# EasyEDA Pro project Milliways.eprj

# Schematic Schematic

## Sheets
1 Input Output: Board Name: Board1; Create Date: 2024-05-10; Page Name: Input Output; Project Name: Milliways; Schematic Name: Schematic; Update Date: 2025-07-20; Company: whitecottage.org.uk; Drawn: Oliver Gardiner; Page Size: A4; Part Number: JLCPCB-002; Reviewed: Oliver Gardiner; Version: V0.1
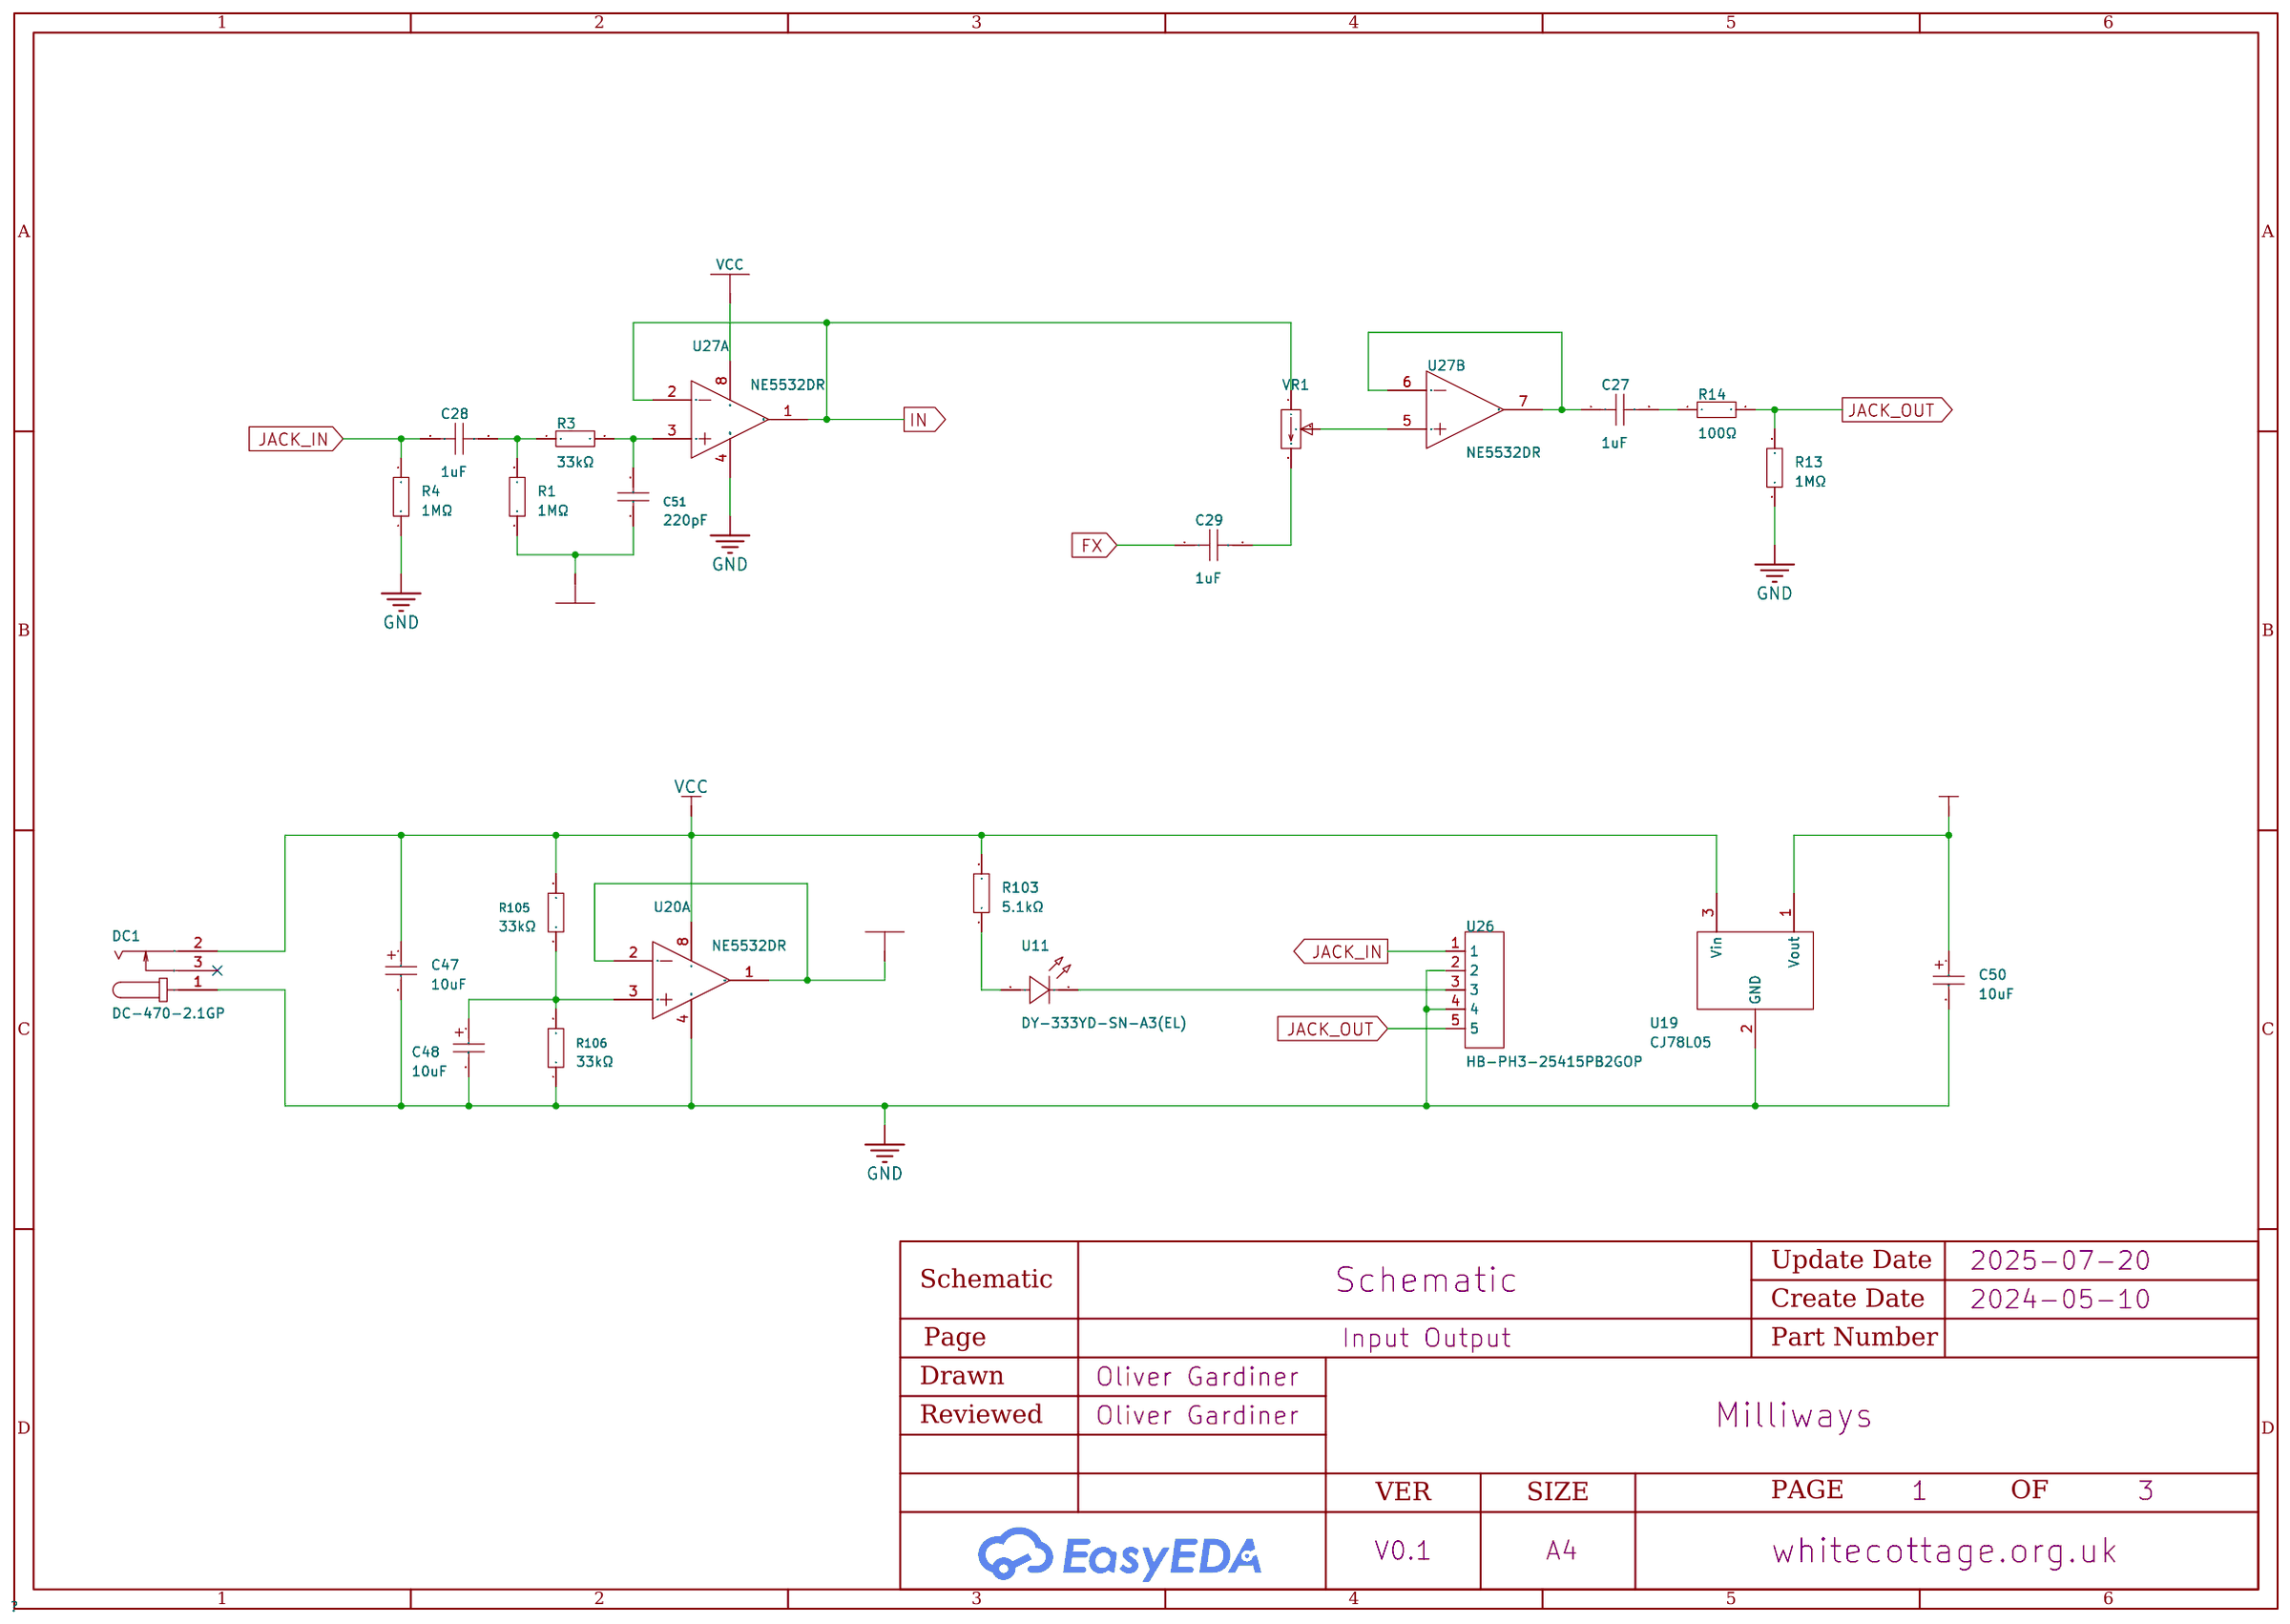
[diagram p0: Input Output]
2 Envelope Detector: Create Date: 2024-05-15; Page Name: Envelope Detector; Update Date: 2025-07-17; Company: EasyEDA.com; Drawn: EasyEDA; Reviewed: EasyEDA
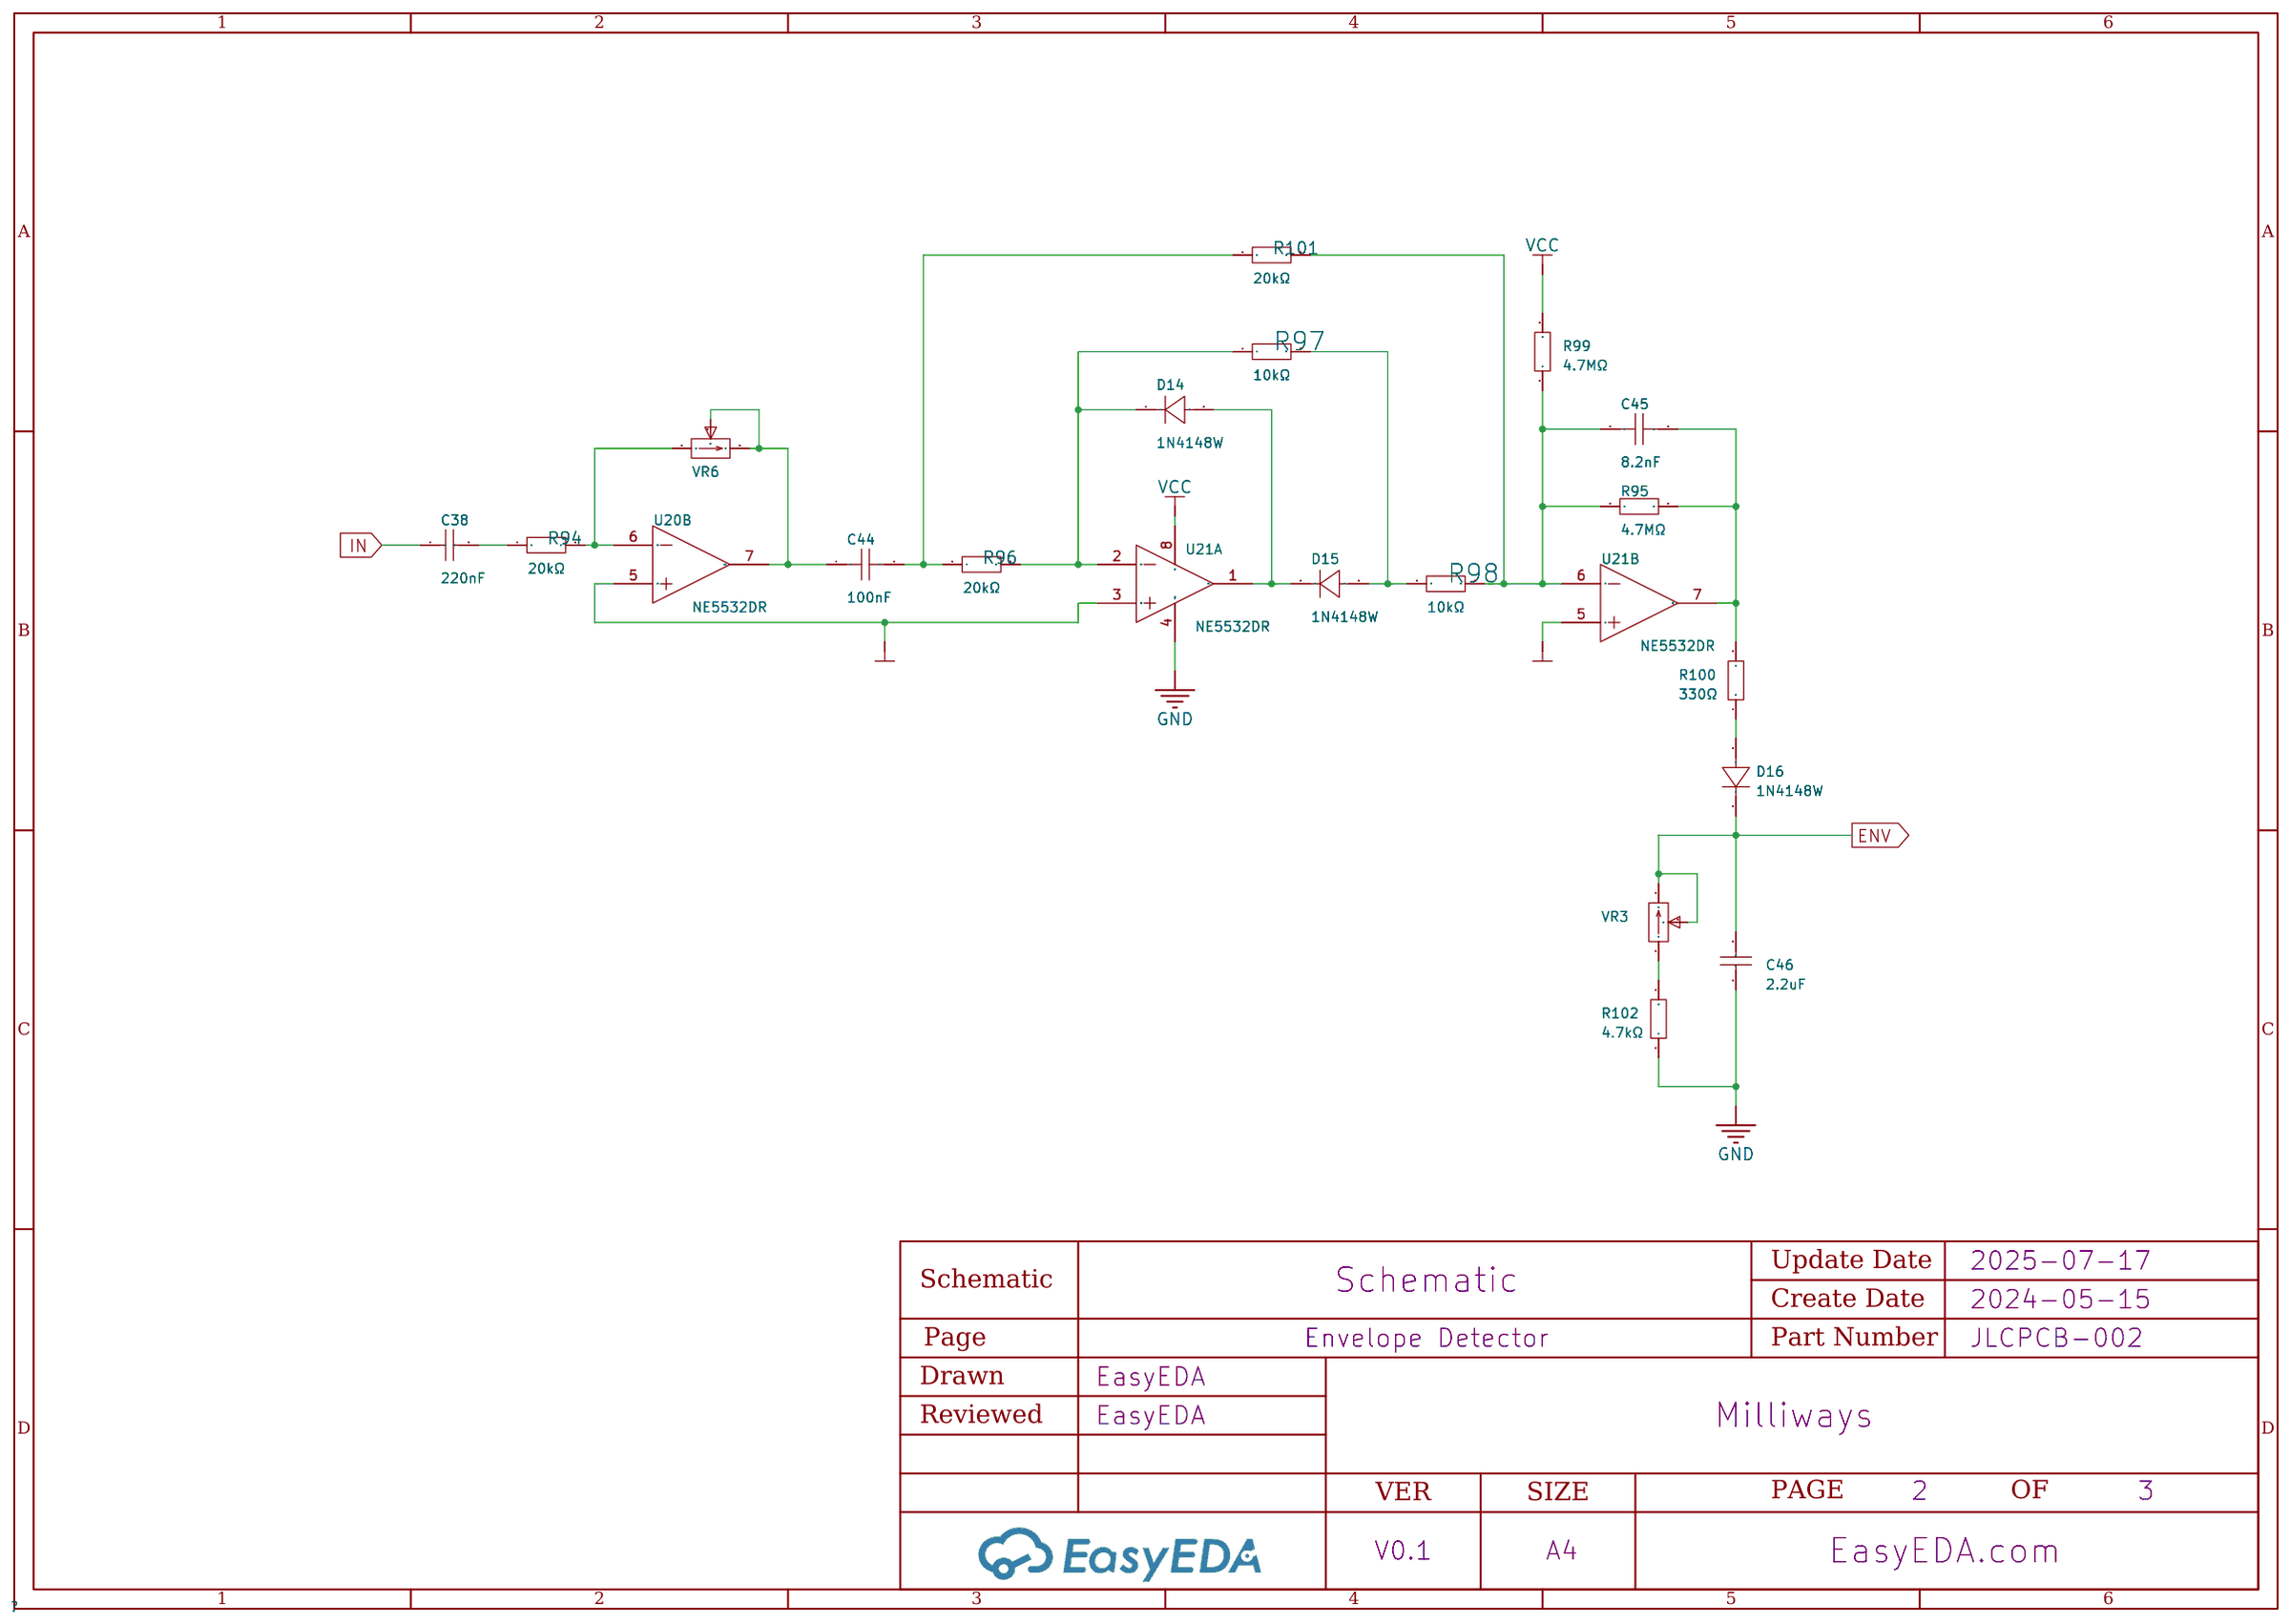
[diagram p1: Envelope Detector]
3 Filter: Create Date: 2024-05-15; Page Name: Filter; Update Date: 2025-07-19; Company: EasyEDA.com; Drawn: EasyEDA; Reviewed: EasyEDA
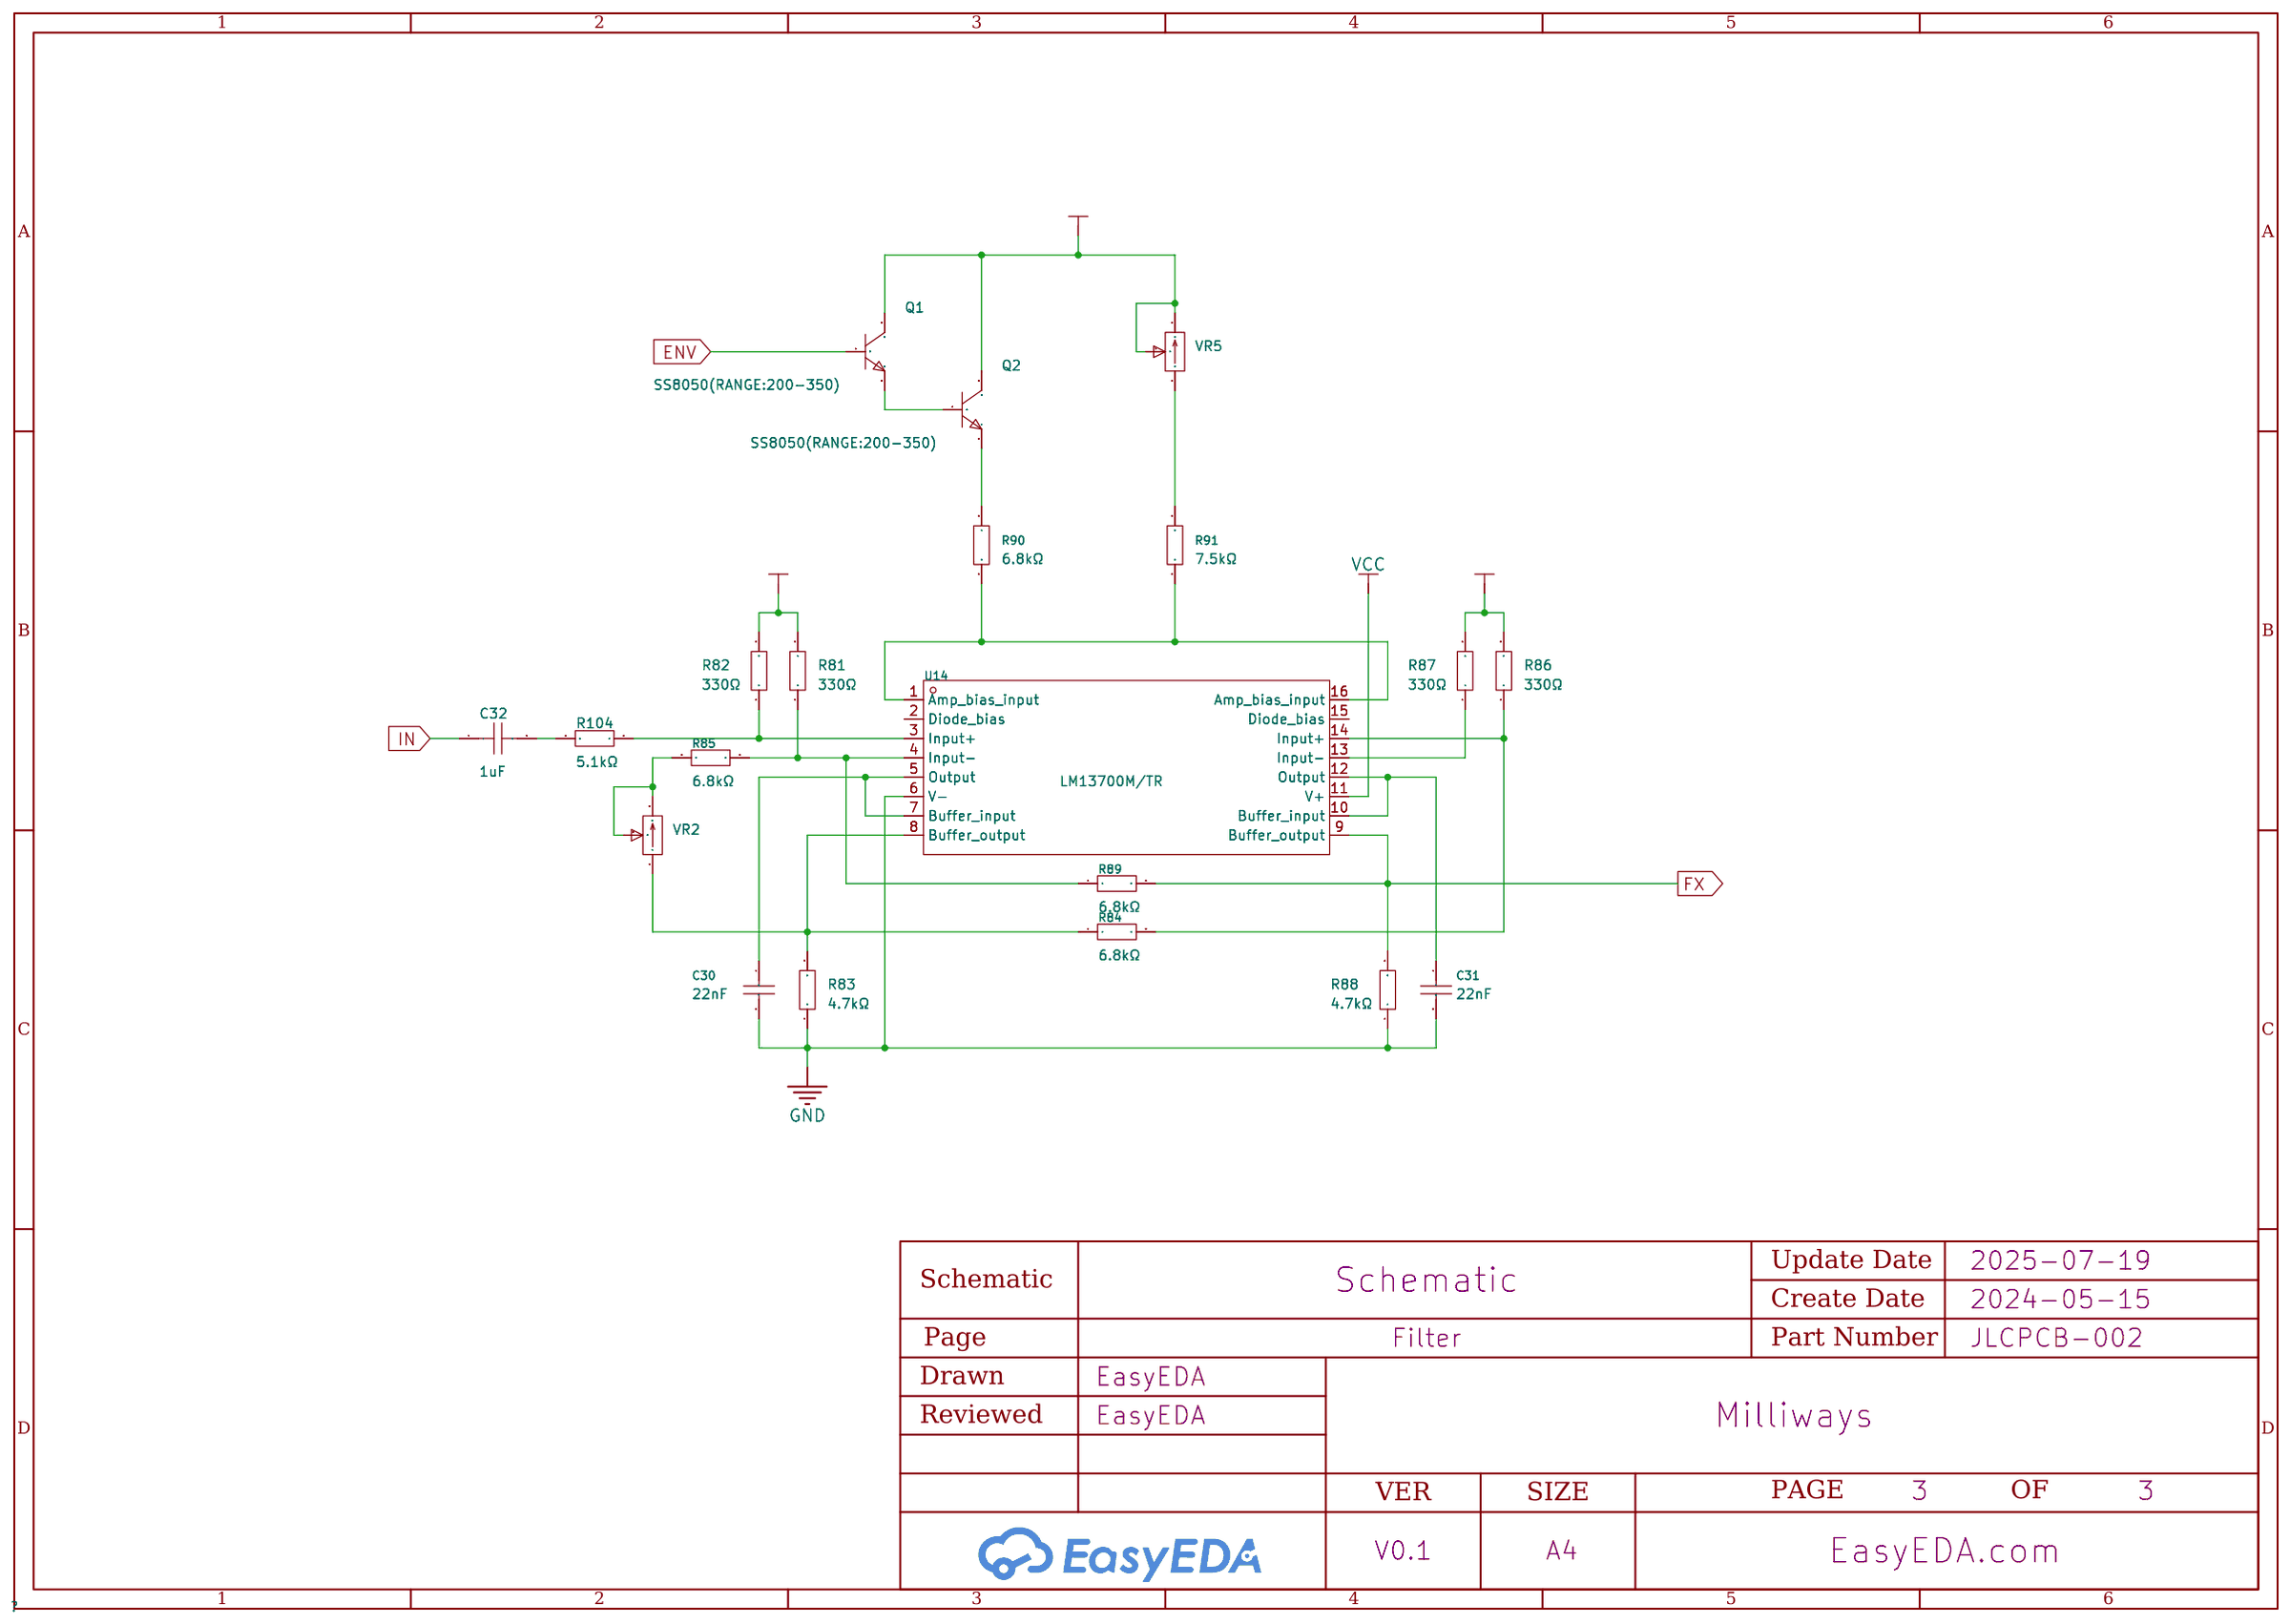
[diagram p2: Filter]

## Parts
sheet Envelope Detector
C38  220nF  [C0603]
C44  100nF  [C0603]
C45  8.2nF  [C0603]
C46  2.2uF  [C0603]
D14  1N4148W  [SOD-123F_L2.7-W1.6-LS3.8-RD]
D15  1N4148W  [SOD-123F_L2.7-W1.6-LS3.8-RD]
D16  1N4148W  [SOD-123F_L2.7-W1.6-LS3.8-RD]
R94  20kΩ  [R0603]
R95  4.7MΩ  [R0603]
R96  20kΩ  [R0603]
R97  10kΩ  [R0603]
R98  10kΩ  [R0603]
R99  4.7MΩ  [R0603]
R100  330Ω  [R0603]
R101  20kΩ  [R0603]
R102  4.7kΩ  [R0603]
U21  NE5532DR  [SOIC-8_L4.9-W3.9-P1.27-LS6.0-BL]  (sections 1,2)
VR3  -  [RD901F]  (no BOM)
VR6  -  [RD901F]  (no BOM)
sheet Filter
C30  22nF  [C0603]
C31  22nF  [C0603]
C32  1uF  [C0603]
Q1  SS8050(RANGE:200-350)  [SOT-23-3_L2.9-W1.3-P1.90-LS2.4-BR]
Q2  SS8050(RANGE:200-350)  [SOT-23-3_L2.9-W1.3-P1.90-LS2.4-BR]
R81  330Ω  [R0603]
R82  330Ω  [R0603]
R83  4.7kΩ  [R0603]
R84  6.8kΩ  [R0603]
R85  6.8kΩ  [R0603]
R86  330Ω  [R0603]
R87  330Ω  [R0603]
R88  4.7kΩ  [R0603]
R89  6.8kΩ  [R0603]
R90  6.8kΩ  [R0603]
R91  7.5kΩ  [R0603]
R104  5.1kΩ  [R0603]
U14  LM13700M/TR  [SOP-16_L9.9-W3.9-P1.27-LS6.0-BL]
VR2  -  [RD901F]  (no BOM)
VR5  -  [RD901F]  (no BOM)
sheet Input Output
C27  1uF  [C0603]
C28  1uF  [C0603]
C29  1uF  [C0603]
C47  10uF  [CAP-SMD_L3.2-W1.6-RD-C7171]
C48  10uF  [CAP-SMD_L3.2-W1.6-RD-C7171]
C50  10uF  [CAP-SMD_L3.2-W1.6-RD-C7171]
C51  220pF  [C0603]
DC1  DC-470-2.1GP  [DC-IN-TH_DC-470-2.1GP]  (no BOM)
R1  1MΩ  [R0603]
R3  33kΩ  [R0603]
R4  1MΩ  [R0603]
R13  1MΩ  [R0603]
R14  100Ω  [R0603]
R103  5.1kΩ  [R0603]
R105  33kΩ  [R0603]
R106  33kΩ  [R0603]
U11  DY-333YD-SN-A3(EL)  [LED-TH_BD5.0-P2.54-FD-1]  (no BOM)
U19  CJ78L05  [SOT-89-3_L4.5-W2.5-P1.50-LS4.2-BR]
U20  NE5532DR  [SOIC-8_L4.9-W3.9-P1.27-LS6.0-BL]  (sections 1,2)
U26  HB-PH3-25415PB2GOP  [HDR-TH_5P-P2.54-V-M]  (no BOM)
U27  NE5532DR  [SOIC-8_L4.9-W3.9-P1.27-LS6.0-BL]  (sections 1,2)
VR1  -  [RD901F]  (no BOM)

## Library data of the parts
C38 = CL10B224KA8NNNC: LCSC Part Name: 220nF ±10% 25V; Supplier Part: C21120; Manufacturer: SAMSUNG(三星); Supplier Footprint: 0603; JLCPCB Part Class: Basic Part; Datasheet: https://atta.szlcsc.com/upload/public/pdf/source/20160218/1457707763339.pdf; Supplier: LCSC; Tolerance: ±10%
C44 = CC0603KRX7R9BB104: Capacitance: Tolerance:±10% Tolerance:±10% Voltage Rated: Temperature Coefficient:; LCSC Part Name: 100nF ±10% 50V; Supplier Part: C14663; Manufacturer: YAGEO(国巨); Supplier Footprint: 0603; JLCPCB Part Class: Basic Part; Datasheet: https://atta.szlcsc.com/upload/public/pdf/source/20180910/C282072_33301C7F631E79921B82A8DAC6BCC5B3.pdf; Supplier: LCSC; Tolerance: ±10%
C45 = 0603B822K500NT: LCSC Part Name: 8.2nF ±10% 50V; Supplier Part: C1322360; Manufacturer: FH(风华); Supplier Footprint: 0603; JLCPCB Part Class: Basic Part; Datasheet: https://atta.szlcsc.com/upload/public/pdf/source/20200305/C486355_26A10D38EF8C2A5C37091D0039909270.pdf; Supplier: LCSC; Tolerance: ±10%; Voltage Rating: 50V; Temperature Coefficient: X7R
C46 = CL10A225KO8NNNC: LCSC Part Name: 2.2uF ±10% 16V; Supplier Part: C23630; Manufacturer: SAMSUNG(三星); Supplier Footprint: 0603; JLCPCB Part Class: Basic Part; Datasheet: https://atta.szlcsc.com/upload/public/pdf/source/20160218/1457707763339.pdf; Supplier: LCSC; Tolerance: ±10%
D14-D16 = 1N4148W_C81598: Diode Configuration: Forward Voltage (Vf@If):1V@50mA Reverse Voltage (Vr): Average Rectified Current (Io): Power Dissipation: Reverse Leakage Current:1uA@75V Reverse Recovery Time (trr): Operating Temperature:- Operating Temperature:-; LCSC Part Name: 电压:75V 电流:150mA; Supplier Part: C81598; Manufacturer: ST(先科); Supplier Footprint: SOD-123; JLCPCB Part Class: Basic Part; Datasheet: https://atta.szlcsc.com/upload/public/pdf/source/20161024/1477288446905.pdf; Supplier: LCSC; Forward Voltage (Vf@If): 1V@50mA; Reverse Leakage Current: 1uA@75V
R94 R96 R101 = 0603WAF2002T5E: LCSC Part Name: 20kΩ ±1% 100mW 厚膜电阻; Supplier Part: C4184; Manufacturer: UNI-ROYAL(厚声); Supplier Footprint: 0603; JLCPCB Part Class: Basic Part; Datasheet: https://atta.szlcsc.com/upload/public/pdf/source/20200306/C422600_1E6D84923E4A46A82E41ADD87F860B5C.pdf; Supplier: LCSC; Type: Thick Film Resistors; Tolerance: ±1%; Temperature Coefficient: ±100ppm/℃; Operating Temperature Range: -55℃~+155℃
R95 R99 = 0603WAF4704T5E: LCSC Part Name: 4.7MΩ ±1% 100mW 厚膜电阻; Supplier Part: C23163; Manufacturer: UNI-ROYAL(厚声); Supplier Footprint: 0603; JLCPCB Part Class: Extended Part; Datasheet: https://atta.szlcsc.com/upload/public/pdf/source/20200306/C422600_1E6D84923E4A46A82E41ADD87F860B5C.pdf; Supplier: LCSC; Type: Thick Film Resistors; Tolerance: ±1%; Temperature Coefficient: ±100ppm/℃; Operating Temperature Range: -55℃~+155℃
R97 R98 = 0603WAF1002T5E: Type:Thick Film Resistor Resistance:10kΩ Tolerance:±1% Tolerance:±1% Power(Watts):100mW Voltage-Supply(Max):75V Temperature Coefficient:±100ppm/℃ Temperature Coefficient:±100ppm/℃ Operating Temperature:-55℃~+155℃ Operating Temperature:-55℃~+155℃; LCSC Part Name: 厚膜电阻 10kΩ ±1% 100mW; Supplier Part: C25804; Manufacturer: UNI-ROYAL(厚声); Supplier Footprint: 0603; JLCPCB Part Class: Basic Part; Datasheet: https://atta.szlcsc.com/upload/public/pdf/source/20200306/C422600_1E6D84923E4A46A82E41ADD87F860B5C.pdf; Supplier: LCSC; Type: Thick Film Resistor; Tolerance: ±1%; Power(Watts): 100mW; Temperature Coefficient: ±100ppm/℃; Voltage-Supply(Max): 75V; Operating Temperature: -55℃~+155℃
R81 R82 R86 R87 R100 = 0603WAF3300T5E: LCSC Part Name: 330Ω ±1% 100mW 厚膜电阻; Supplier Part: C23138; Manufacturer: UNI-ROYAL(厚声); Supplier Footprint: 0603; JLCPCB Part Class: Basic Part; Datasheet: https://atta.szlcsc.com/upload/public/pdf/source/20200306/C422600_1E6D84923E4A46A82E41ADD87F860B5C.pdf; Supplier: LCSC; Type: Thick Film Resistors; Tolerance: ±1%; Temperature Coefficient: ±100ppm/℃; Operating Temperature Range: -55℃~+155℃
R83 R88 R102 = 0603WAF4701T5E: Type:Thick Film Resistors Resistance:4.7kΩ Tolerance:±1% Tolerance:±1% Power(Watts): Overload Voltage (Max): Temperature Coefficient:±100ppm/℃ Temperature Coefficient:±100ppm/℃ Operating Temperature Range:-55℃~+155℃ Operating Temperature Range:-55℃~+155℃; LCSC Part Name: 4.7kΩ ±1% 100mW 厚膜电阻; Supplier Part: C23162; Manufacturer: UNI-ROYAL(厚声); Supplier Footprint: 0603; JLCPCB Part Class: Basic Part; Datasheet: https://atta.szlcsc.com/upload/public/pdf/source/20200306/C422600_1E6D84923E4A46A82E41ADD87F860B5C.pdf; Supplier: LCSC; Type: Thick Film Resistors; Tolerance: ±1%; Temperature Coefficient: ±100ppm/℃; Operating Temperature Range: -55℃~+155℃
U20 U21 U27 = NE5532DR: Supplier Part: C7426; Manufacturer: TI(德州仪器); Supplier Footprint: SOIC-8; JLCPCB Part Class: Basic Part; Datasheet: http://www.ti.com/cn/lit/gpn/ne5532; Supplier: LCSC; Number of Circuits: 双路; Gain Bandwidth Product(GBP): 10MHz; Current - Input Bias(Ib): 200nA; Slew Rate(SR): 9V/us; Output Current: 38mA; Supply Current: 8mA; Operating Temperature: 0℃~+70℃
VR3 = RD901F: Resistance: C1M
VR6 = RD901F: Resistance: B100k
C30 C31 = CL10B223KB8NNNC: LCSC Part Name: 22nF ±10% 50V; Supplier Part: C21122; Manufacturer: SAMSUNG(三星); Supplier Footprint: 0603; JLCPCB Part Class: Basic Part; Datasheet: https://atta.szlcsc.com/upload/public/pdf/source/20160218/1457707763339.pdf; Supplier: LCSC; Tolerance: ±10%
C27-C29 C32 = CL10A105KB8NNNC: Capacitance: Tolerance:±10% Tolerance:±10% Voltage Rated: Temperature Coefficient:; LCSC Part Name: 1uF ±10% 50V; Supplier Part: C15849; Manufacturer: SAMSUNG(三星); Supplier Footprint: 0603; JLCPCB Part Class: Basic Part; Datasheet: https://atta.szlcsc.com/upload/public/pdf/source/20160218/1457707763339.pdf; Supplier: LCSC; Tolerance: ±10%
Q1 Q2 = SS8050(RANGE:200-350)_C2150: LCSC Part Name: NPN 电流:1.5A 耐压:25V hfe=200~350; Supplier Part: C2150; Manufacturer: CJ(江苏长电/长晶); Supplier Footprint: SOT-23; JLCPCB Part Class: Basic Part; Datasheet: https://atta.szlcsc.com/upload/public/pdf/source/20230322/AEE86F4B043774EFF80CAEA14A37D9E9.pdf; Supplier: LCSC; DC Current Gain (hFE@Ic,Vce): 200@800mA,1V; Transition Frequency (fT): 100MHz; Collector Cut-Off Current (Icbo): 100nA; Collector-Emitter Saturation Voltage (VCE(sat)@Ic,Ib): 500mV@800mA,80mA; Operating Temperature: -55℃~+150℃
R84 R85 R89 R90 = 0603WAF6801T5E: LCSC Part Name: 6.8kΩ ±1% 100mW 厚膜电阻; Supplier Part: C23212; Manufacturer: UNI-ROYAL(厚声); Supplier Footprint: 0603; JLCPCB Part Class: Basic Part; Datasheet: https://atta.szlcsc.com/upload/public/pdf/source/20200306/C422600_1E6D84923E4A46A82E41ADD87F860B5C.pdf; Supplier: LCSC; Type: Thick Film Resistors; Tolerance: ±1%; Temperature Coefficient: ±100ppm/℃; Operating Temperature Range: -55℃~+155℃
R91 = 0603WAF7501T5E: LCSC Part Name: 7.5kΩ ±1% 100mW 厚膜电阻; Supplier Part: C23234; Manufacturer: UNI-ROYAL(厚声); Supplier Footprint: 0603; JLCPCB Part Class: Basic Part; Datasheet: https://atta.szlcsc.com/upload/public/pdf/source/20200306/C422600_1E6D84923E4A46A82E41ADD87F860B5C.pdf; Supplier: LCSC; Type: Thick Film Resistors; Tolerance: ±1%; Temperature Coefficient: ±100ppm/℃; Operating Temperature Range: -55℃~+155℃
R103 R104 = 0603WAF5101T5E: Type:Thick Film Resistors Resistance:5.1kΩ Tolerance:±1% Tolerance:±1% Power(Watts): Overload Voltage (Max): Temperature Coefficient:±100ppm/℃ Temperature Coefficient:±100ppm/℃ Operating Temperature Range:-55℃~+155℃ Operating Temperature Range:-55℃~+155℃; LCSC Part Name: 5.1kΩ ±1% 100mW 厚膜电阻; Supplier Part: C23186; Manufacturer: UNI-ROYAL(厚声); Supplier Footprint: 0603; JLCPCB Part Class: Basic Part; Datasheet: https://atta.szlcsc.com/upload/public/pdf/source/20200306/C422600_1E6D84923E4A46A82E41ADD87F860B5C.pdf; Supplier: LCSC; Type: Thick Film Resistors; Tolerance: ±1%; Temperature Coefficient: ±100ppm/℃; Operating Temperature Range: -55℃~+155℃
U14 = LM13700M/TR: Supplier Part: C5160094; Manufacturer: HGSEMI(华冠); Supplier Footprint: SOP-16; JLCPCB Part Class: Extended Part; Datasheet: https://atta.szlcsc.com/upload/public/pdf/source/20220926/61E6103D170538F3CE10479EC2C58EF2.pdf; Supplier: LCSC
VR2 VR5 = RD901F: Resistance: B50K
C47 C48 C50 = TAJA106K016RNJ: LCSC Part Name: 10uF ±10% 16V; Supplier Part: C7171; Manufacturer: Kyocera AVX; Supplier Footprint: CASE-A-3216-18(mm); JLCPCB Part Class: Basic Part; Supplier: LCSC; Tolerance: ±10%; Voltage Rating: 16V; Equivalent Series Resistance(ESR): 3Ω@100kHz; Operating Temperature: -55℃~+125℃
C51 = CL10B221KB8NNNC: LCSC Part Name: 220pF ±10% 50V; Supplier Part: C1603; Manufacturer: SAMSUNG(三星); Supplier Footprint: 0603; JLCPCB Part Class: Basic Part; Datasheet: https://atta.szlcsc.com/upload/public/pdf/source/20160218/1457707763339.pdf; Supplier: LCSC; Tolerance: ±10%
DC1 = DC-470-2.1GP: Connector Type:DC Power Receptacle Mounting Style:Right-Angle Inside Contact Diameter:2.1mm Outside Contact Diameter:6.3mm Current Rating (Max):500mA Voltage Rating (Max):30V Contact Material:- Contact Plating:- Operating Temperature Range:-40℃~+55℃ Opera; LCSC Part Name: DC电源插座 内径:2.1mm 外径:6.3mm; Supplier Part: C194407; Manufacturer: GANGYUAN(港源); Supplier Footprint: 插件; JLCPCB Part Class: Extended Part; Datasheet: https://atta.szlcsc.com/upload/public/pdf/source/20180622/C194407_A8415BB52DCD8B2707DD756772886C27.pdf; Supplier: LCSC; Connector Type: DC Power Receptacle; Mounting Style: Right-Angle; Inside Contact Diameter: 2.1mm; Outside Contact Diameter: 6.3mm; Current Rating (Max): 500mA; Voltage Rating (Max): 30V; Operating Temperature Range: -40℃~+55℃
R1 R4 R13 = 0603WAF1004T5E: Type:Thick Film Resistors Resistance:1MΩ Tolerance:±1% Tolerance:±1% Power(Watts): Overload Voltage (Max): Temperature Coefficient:±100ppm/℃ Temperature Coefficient:±100ppm/℃ Operating Temperature Range:-55℃~+155℃ Operating Temperature Range:-55℃~+155℃; LCSC Part Name: 1MΩ ±1% 100mW 厚膜电阻; Supplier Part: C22935; Manufacturer: UNI-ROYAL(厚声); Supplier Footprint: 0603; JLCPCB Part Class: Basic Part; Datasheet: https://atta.szlcsc.com/upload/public/pdf/source/20200306/C422600_1E6D84923E4A46A82E41ADD87F860B5C.pdf; Supplier: LCSC; Type: Thick Film Resistors; Tolerance: ±1%; Temperature Coefficient: ±100ppm/℃; Operating Temperature Range: -55℃~+155℃
R3 R105 R106 = 0603WAF3302T5E: Type:Thick Film Resistors Resistance:33kΩ Tolerance:±1% Tolerance:±1% Power(Watts): Overload Voltage (Max): Temperature Coefficient:±100ppm/℃ Temperature Coefficient:±100ppm/℃ Operating Temperature Range:-55℃~+155℃ Operating Temperature Range:-55℃~+155℃; LCSC Part Name: 33kΩ ±1% 100mW 厚膜电阻; Supplier Part: C4216; Manufacturer: UNI-ROYAL(厚声); Supplier Footprint: 0603; JLCPCB Part Class: Basic Part; Datasheet: https://atta.szlcsc.com/upload/public/pdf/source/20200306/C422600_1E6D84923E4A46A82E41ADD87F860B5C.pdf; Supplier: LCSC; Type: Thick Film Resistors; Tolerance: ±1%; Temperature Coefficient: ±100ppm/℃; Operating Temperature Range: -55℃~+155℃
R14 = 0603WAF1000T5E: Type:Thick Film Resistors Resistance: Tolerance:±1% Tolerance:±1% Power(Watts): Overload Voltage (Max): Temperature Coefficient:±200ppm/℃ Temperature Coefficient:±200ppm/℃ Operating Temperature Range:-55℃~+155℃ Operating Temperature Range:-55℃~+155℃; LCSC Part Name: 100Ω ±1% 100mW 厚膜电阻; Supplier Part: C22775; Manufacturer: UNI-ROYAL(厚声); Supplier Footprint: 0603; JLCPCB Part Class: Basic Part; Datasheet: https://atta.szlcsc.com/upload/public/pdf/source/20200306/C422600_1E6D84923E4A46A82E41ADD87F860B5C.pdf; Supplier: LCSC; Type: Thick Film Resistors; Tolerance: ±1%; Temperature Coefficient: ±200ppm/℃; Operating Temperature Range: -55℃~+155℃
U11 = DY-333YD-SN-A3(EL): LCSC Part Name: 发光二极管; Supplier Part: C7470706; Manufacturer: TONYU(东裕); Supplier Footprint: D=5mm; JLCPCB Part Class: Extended Part; Datasheet: https://atta.szlcsc.com/upload/public/pdf/source/20230726/919B43C7357EC2599F3FC0062BA91E02.pdf; Supplier: LCSC
U19 = CJ78L05_C2079: Output Type:Fixed Voltage - Supply:30V Output Voltage:5V Output Voltage:5V Output Current:100mA Voltage Dropout:1.7V@(40mA) Output Configuration:Positive electrode Number of Outputs:1; LCSC Part Name: 输入30V 输出5V 100mA; Supplier Part: C2079; Manufacturer: CJ(江苏长电/长晶); Supplier Footprint: SOT-89-3L; JLCPCB Part Class: Extended Part; Datasheet: https://atta.szlcsc.com/upload/public/pdf/source/20171228/C164903_15144413069831213906.pdf; Supplier: LCSC; Output Type: Fixed; Voltage - Supply: 30V; Output Voltage: 5V; Output Current: 100mA; Voltage Dropout: 1.7V@(40mA); Output Configuration: Positive electrode; Number of Outputs: 1
U26 = HB-PH3-25415PB2GOP: Pin Structure:1x5P Pitch:2.54mm Row Spacing:2.54mm Circluar Pins/Square Pins:Policy Mounting Type:Straight Number of Rows:Single Row Number of Pins:5P Current Rating:3A Voltage Rating (Max):250V Length of Mating Pin:6mm Insulation Height:2.54mm Length of; LCSC Part Name: 1x5P 间距:2.54mm 方针 直插; Supplier Part: C6332198; Manufacturer: HANBO(汉博); Supplier Footprint: 插件,P=2.54mm; JLCPCB Part Class: Extended Part; Datasheet: https://atta.szlcsc.com/upload/public/pdf/source/20230803/F72D259687963761DF1B552F3BB84A31.pdf; Supplier: LCSC; Pin Structure: 1x5P; Pitch: 2.54mm; Row Spacing: 2.54mm; Circluar Pins/Square Pins: Policy; Mounting Type: Straight; Number of Rows: Single Row; Number of Pins: 5P; Current Rating: 3A; Voltage Rating (Max): 250V; Length of Mating Pin: 6mm; Insulation Height: 2.54mm; Length of End Connection Pin: 3mm; Contact Material: Brass; Contact Plating: Gold; Operating Temperature: -40℃~+105℃; Color: Black
VR1 = RD901F: Resistance: B100K

## Nets
+5V: C50.1 Q1.3(C) Q2.3(C) U19.1(Vout) VR5.2 VR5.3
GND: C30.2 C31.2 C46.1 C47.2 C48.2 C50.2 DC1.1 R4.1 R13.1 R83.1 R88.1 R102.1 R106.1 U14.6(V-) U19.2(GND) U20.4(VCC-/GND) U21.4(VCC-/GND) U26.2 U26.4 U27.4(VCC-/GND)
VCC: C47.1 DC1.2 R99.2 R103.2 R105.2 U14.11(V+) U19.3(Vin) U20.8(VCC+) U21.8(VCC+) U27.8(VCC+)
ENV: C46.2 D16.1(K) Q1.1(B) VR3.2 VR3.3
FX: C29.1 R88.2 R89.2 U14.9(Buffer_output)
IN: C32.1 C38.1 U27.1(OUT1) U27.2(IN1-) VR1.1
JACK_IN: C28.1 R4.2 U26.1
JACK_OUT: R13.2 R14.2 U26.5
VREF: C51.1 R1.1 R81.2 R82.2 R86.2 R87.2 U20.1(OUT1) U20.2(IN1-) U20.5(IN2+) U21.3(IN1+) U21.5(IN2+)
$1N6634: R103.1 U11.1(A)
$1N12632: C48.1 R105.1 R106.2 U20.3(IN1+)
$1N13415: C28.2 R1.2 R3.1
$1N13416: C51.2 R3.2 U27.3(IN1+)
$1N13421: C27.2 R14.1
$1N13425: C29.2 VR1.3
$1N13428: C27.1 U27.6(IN2-) U27.7(OUT2)
$1N13429: U27.5(IN2+) VR1.2
$1N13550: U11.2(K) U26.3
$4N2873: C44.1 U20.7(OUT2) VR6.2 VR6.3
$4N3799: C44.2 R96.1 R101.1
$4N3804: D14.1(K) R96.2 R97.1 U21.2(IN1-)
$4N3875: D14.2(A) D15.1(K) U21.1(OUT1)
$4N4025: D15.2(A) R97.2 R98.1
$4N4078: C45.2 R95.2 R100.2 U21.7(OUT2)
$4N4084: C45.1 R95.1 R98.2 R99.1 R101.2 U21.6(IN2-)
$4N4197: R94.2 U20.6(IN2-) VR6.1
$4N4200: C38.2 R94.1
$4N4289: D16.2(A) R100.1
$4N4526: R102.2 VR3.1
$5N1600: C30.1 U14.5(Output) U14.7(Buffer_input)
$5N2883: R83.2 R84.1 U14.8(Buffer_output) VR2.1
$5N3271: C31.1 U14.10(Buffer_input) U14.12(Output)
$5N4878: R82.1 R104.1 U14.3(Input+)
$5N4886: R81.1 R85.2 R89.1 U14.4(Input-)
$5N5245: R85.1 VR2.2 VR2.3
$5N5371: R87.1 U14.13(Input-)
$5N5377: R84.2 R86.1 U14.14(Input+)
$5N5607: C32.2 R104.2
$5N5701: R90.1 R91.1 U14.1(Amp_bias_input) U14.16(Amp_bias_input)
$5N5821: Q1.2(E) Q2.1(B)
$5N6853: Q2.2(E) R90.2
$5N6944: R91.2 VR5.1

Not connected (* = marked no-connect by the designer): DC1 3*; U14 2(Diode_bias) 15(Diode_bias)

# Board PCB1
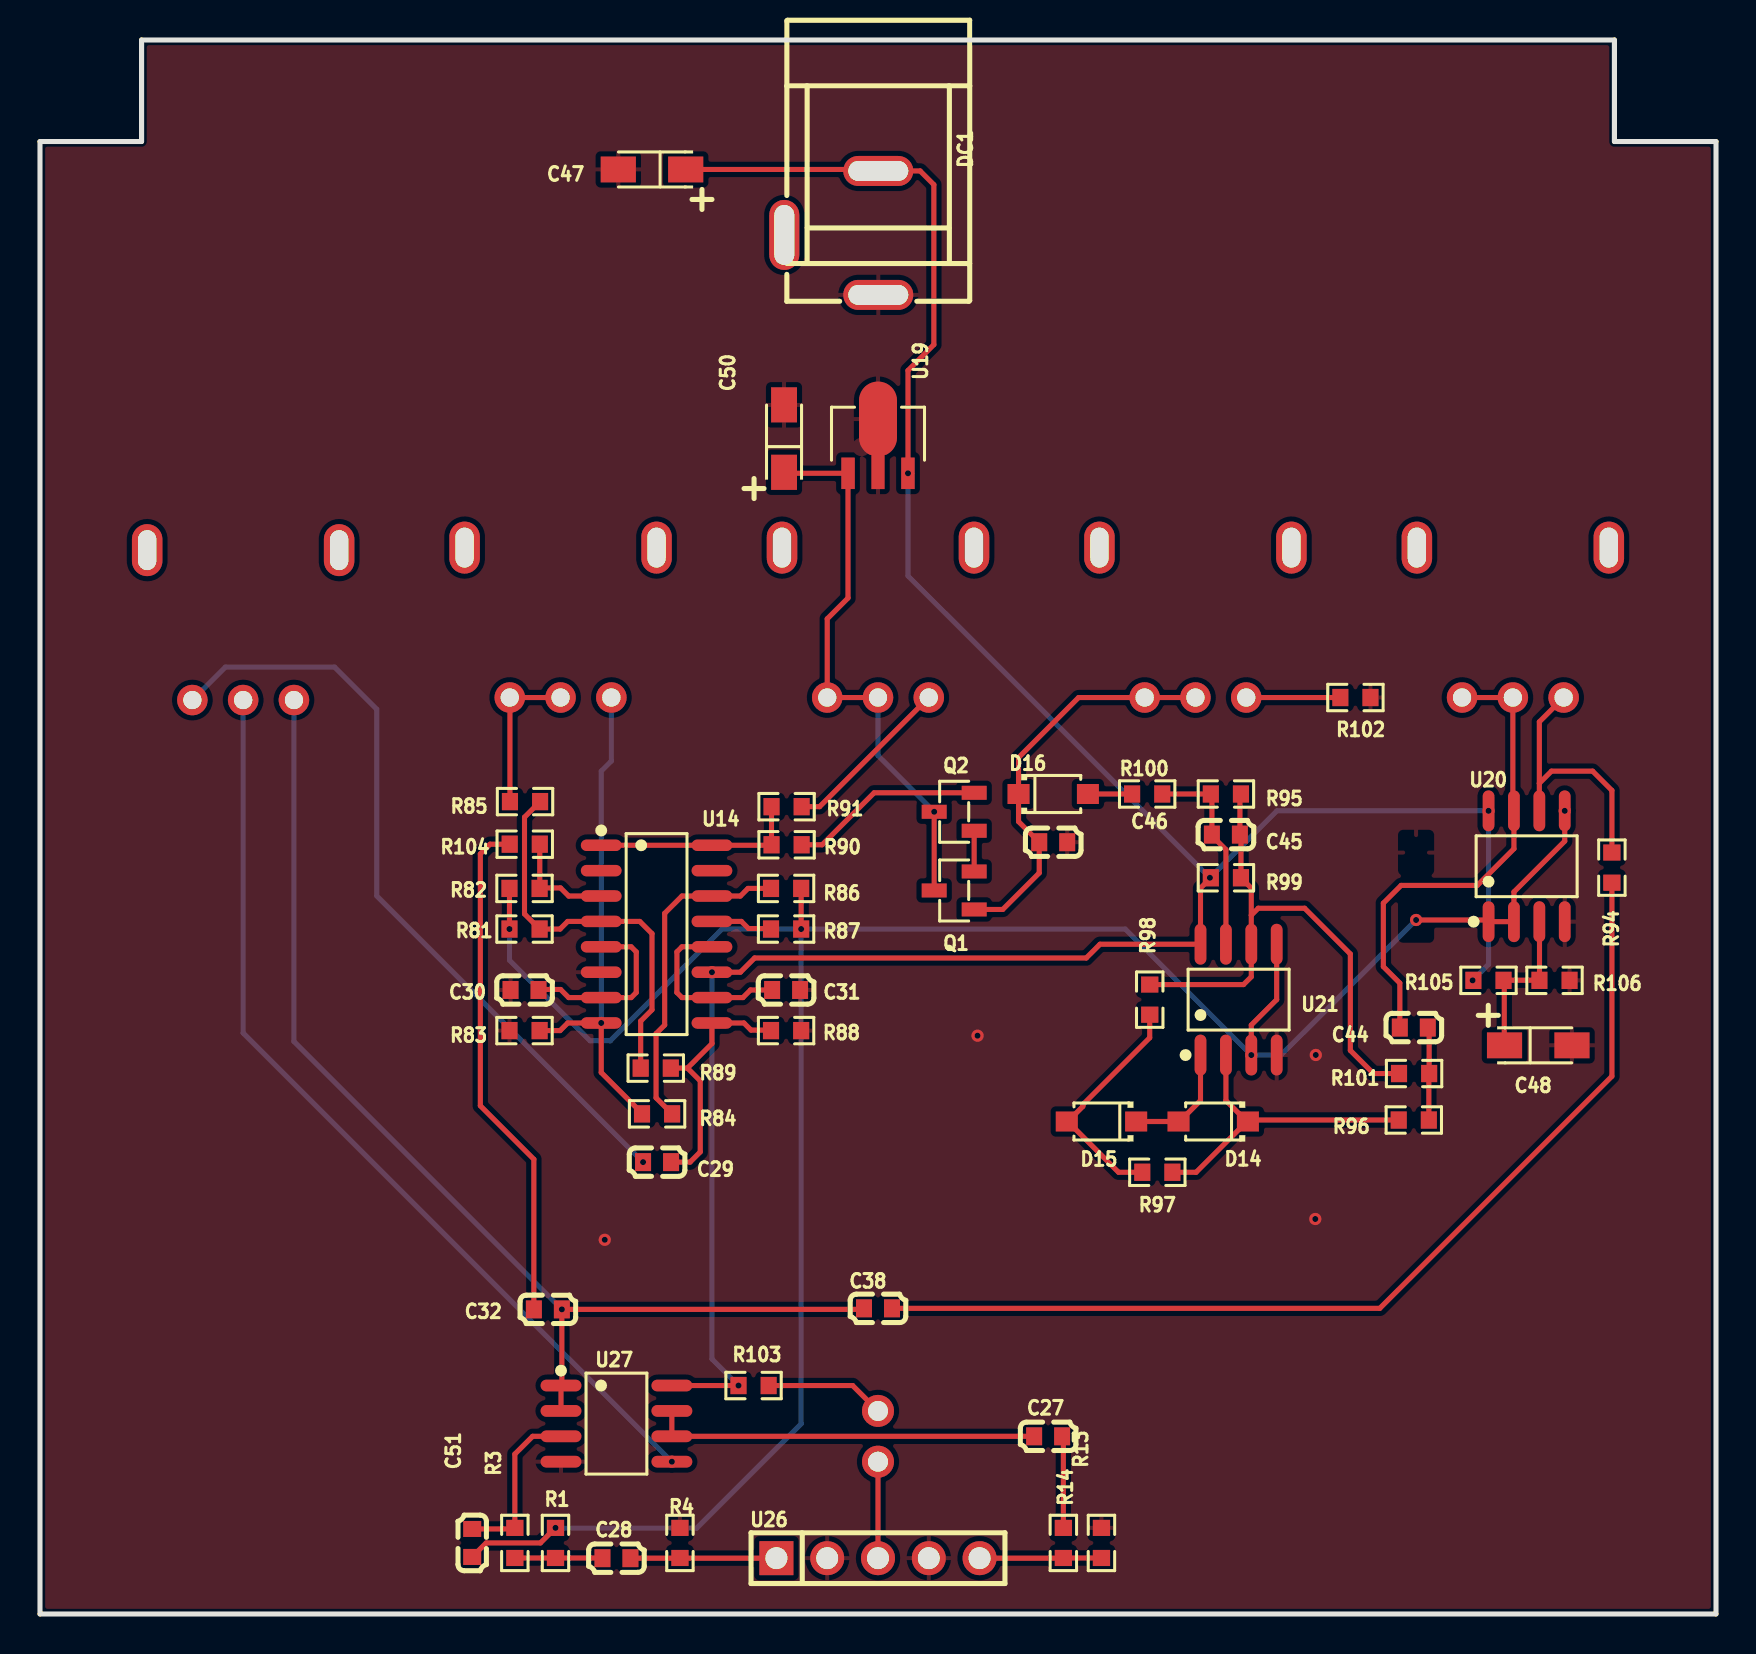
[diagram p3: board, top side]
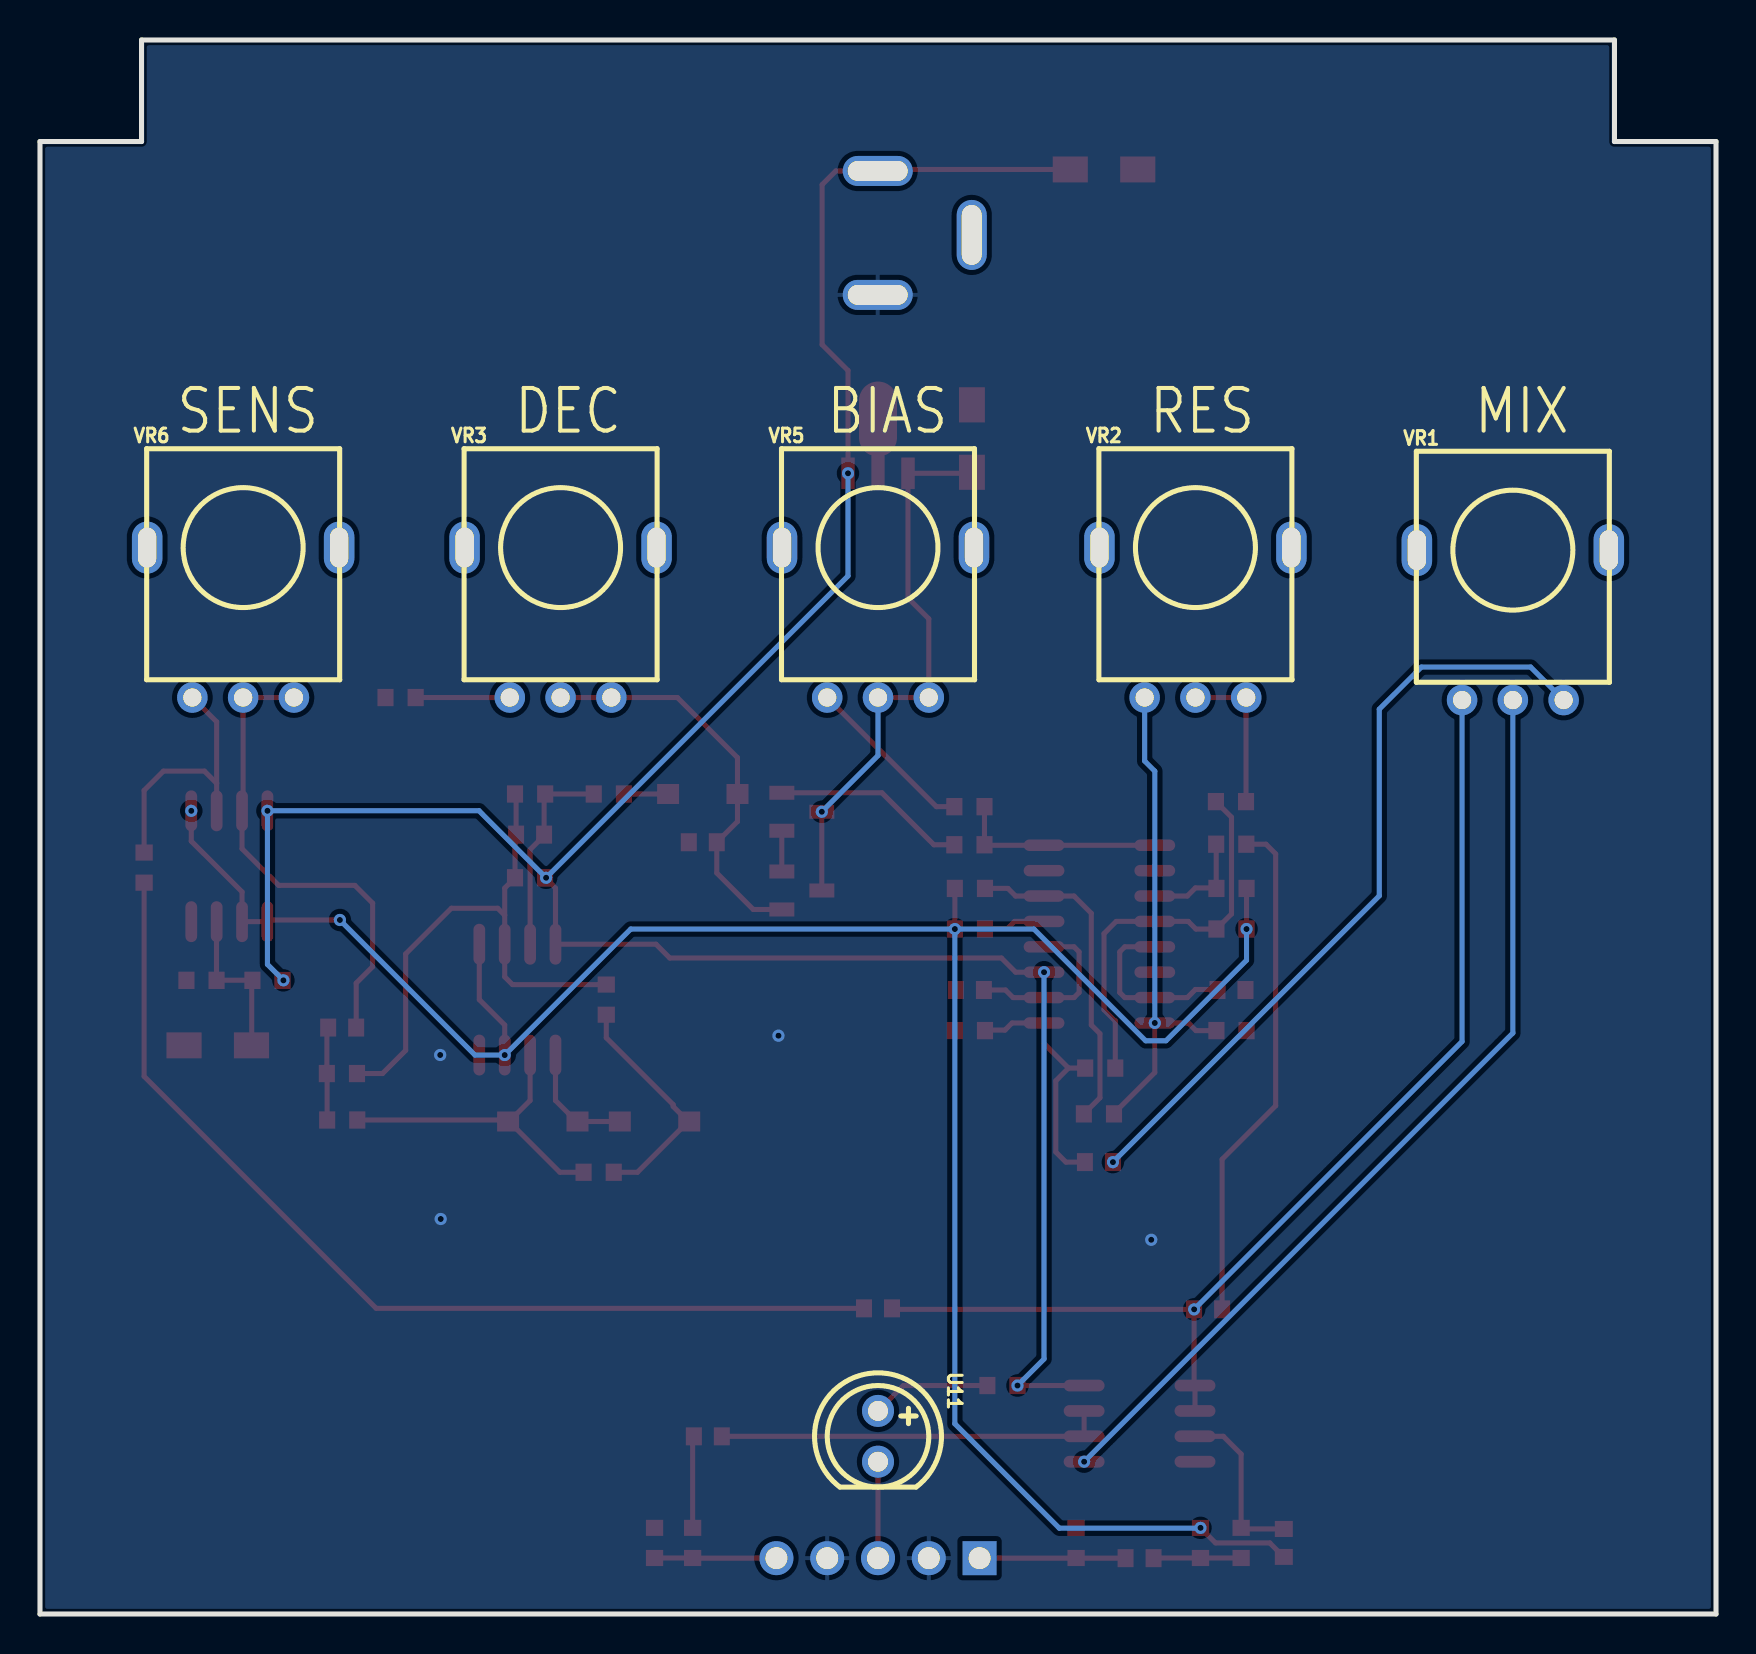
[diagram p4: board, bottom side, seen from below]

Outline 83.82 x 78.74 mm; copper layers: Top Layer, Bottom Layer. Coordinates in mm from the lower left corner of the outline.
Outline path: 0,73.66 5.08,73.66 5.08,78.74 78.74,78.74 78.74,73.66 83.82,73.66 83.82,0 0,0 0,73.66
Stack: Top Layer 0.035mm / Dielectric1 1.51mm FR4 er 4.5 / Bottom Layer 0.035mm

## Design rules (mm)
template: JLCPCB Capability(Two Layers Board)
spacing copperThickness1oz (default): track to track 0.102, other pairs 0.152 to 0.3
spacing copperThickness2oz: track to track 0.203, other pairs 0.152 to 0.3
track width copperThickness1oz (default): min 0.127, default 0.254, max 2.54
track width copperThickness2oz: min 0.203, default 0.254, max 2.54
differential pair differentialPair (default): width min 0.127, default 0.254, max 2.54; gap min 0.152, default 0.152
via viaSize (default): diameter min 0.5, default 0.61, max 10; hole min 0.3, default 0.305, max 6.3

## Placement (name value [footprint] x y rotation side)
C27  1uF  [C0603]  50.42 8.89 0 top
C28  1uF  [C0603]  28.83 2.79 180 top
C29  1uF  [C0603]  30.86 22.61 180 top
C30  22nF  [C0603]  24.23 31.22 180 top
C31  22nF  [C0603]  37.31 31.22 0 top
C32  1uF  [C0603]  25.4 15.24 180 top
C38  220nF  [C0603]  41.91 15.29 0 top
C44  100nF  [C0603]  68.71 29.34 0 top
C45  8.2nF  [C0603]  59.31 38.99 180 top
C46  2.2uF  [C0603]  50.67 38.61 180 top
C47  10uF  [CAP-SMD_L3.2-W1.6-RD-C7171]  30.61 72.26 180 top
C48  10uF  [CAP-SMD_L3.2-W1.6-RD-C7171]  74.93 28.45 0 top
C50  10uF  [CAP-SMD_L3.2-W1.6-RD-C7171]  37.21 58.8 90 top
C51  220pF  [C0603]  21.62 3.56 90 top
D14  1N4148W  [SOD-123F_L2.7-W1.6-LS3.8-RD]  58.67 24.64 180 top
D15  1N4148W  [SOD-123F_L2.7-W1.6-LS3.8-RD]  53.09 24.64 180 top
D16  1N4148W  [SOD-123F_L2.7-W1.6-LS3.8-RD]  50.67 41.02 0 top
DC1  DC-470-2.1GP  [DC-IN-TH_DC-470-2.1GP]  39.57 69.09 270 top
Q1  SS8050(RANGE:200-350)  [SOT-23-3_L2.9-W1.3-P1.90-LS2.4-BR]  45.72 36.19 0 top
Q2  SS8050(RANGE:200-350)  [SOT-23-3_L2.9-W1.3-P1.90-LS2.4-BR]  45.72 40.13 0 top
R1  1MΩ  [R0603]  25.78 3.56 270 top
R3  33kΩ  [R0603]  23.75 3.56 90 top
R4  1MΩ  [R0603]  32 3.56 270 top
R13  1MΩ  [R0603]  53.09 3.56 270 top
R14  100Ω  [R0603]  51.18 3.56 270 top
R81  330Ω  [R0603]  24.23 34.27 180 top
R82  330Ω  [R0603]  24.23 36.3 180 top
R83  4.7kΩ  [R0603]  24.23 29.19 0 top
R84  6.8kΩ  [R0603]  30.86 25.02 0 top
R85  6.8kΩ  [R0603]  24.26 40.64 0 top
R86  330Ω  [R0603]  37.31 36.3 0 top
R87  330Ω  [R0603]  37.31 34.27 0 top
R88  4.7kΩ  [R0603]  37.31 29.19 180 top
R89  6.8kΩ  [R0603]  30.8 27.31 0 top
R90  6.8kΩ  [R0603]  37.34 38.48 0 top
R91  7.5kΩ  [R0603]  37.34 40.39 0 top
R94  20kΩ  [R0603]  78.61 37.34 90 top
R95  4.7MΩ  [R0603]  59.31 41.02 180 top
R96  20kΩ  [R0603]  68.71 24.71 180 top
R97  10kΩ  [R0603]  55.88 22.1 180 top
R98  10kΩ  [R0603]  55.5 30.73 90 top
R99  4.7MΩ  [R0603]  59.31 36.83 180 top
R100  330Ω  [R0603]  55.37 41.02 0 top
R101  20kΩ  [R0603]  68.72 27.04 180 top
R102  4.7kΩ  [R0603]  65.79 45.85 180 top
R103  5.1kΩ  [R0603]  35.69 11.43 180 top
R104  5.1kΩ  [R0603]  24.24 38.51 180 top
R105  33kΩ  [R0603]  72.44 31.7 180 top
R106  33kΩ  [R0603]  75.74 31.7 180 top
U11  DY-333YD-SN-A3(EL)  [LED-TH_BD5.0-P2.54-FD-1]  41.91 8.89 270 bottom
U14  LM13700M/TR  [SOP-16_L9.9-W3.9-P1.27-LS6.0-BL]  30.84 34.01 270 top
U19  CJ78L05  [SOT-89-3_L4.5-W2.5-P1.50-LS4.2-BR]  41.91 58.42 270 top
U20  NE5532DR  [SOIC-8_L4.9-W3.9-P1.27-LS6.0-BL]  74.35 37.41 0 top
U21  NE5532DR  [SOIC-8_L4.9-W3.9-P1.27-LS6.0-BL]  59.94 30.73 0 top
U26  HB-PH3-25415PB2GOP  [HDR-TH_5P-P2.54-V-M]  41.91 2.79 0 top
U27  NE5532DR  [SOIC-8_L4.9-W3.9-P1.27-LS6.0-BL]  28.83 9.53 270 top
VR1  -  [RD901F]  10.16 45.72 180 bottom
VR2  -  [RD901F]  26.03 45.85 180 bottom
VR3  -  [RD901F]  57.78 45.85 180 bottom
VR5  -  [RD901F]  41.91 45.85 180 bottom
VR6  -  [RD901F]  73.66 45.85 180 bottom

## Footprints (pads in the part's own frame, mm; a bottom-side part is the same pattern mirrored in y, then rotated)
C0603
  rect 0.8x0.9 smd: 1(-0.7,0) 2(0.7,0)
CAP-SMD_L3.2-W1.6-RD-C7171
  rect 1.758x1.296 smd: 1(-1.687,0) 2(1.687,0)
DC-IN-TH_DC-470-2.1GP
  oval 1.5x3.5 hole 1x3: 1(3.1,2.35) 2(-3.1,2.35)
  oval 3.5x1.5 hole 3x1: 3(0.1,-2.35)
HDR-TH_5P-P2.54-V-M
  rect 1.7x1.7 hole 1.1: 1(-5.08,0)
  round 1.7 hole 1.1: 2(-2.54,0) 3(0,0) 4(2.54,0) 5(5.08,0)
LED-TH_BD5.0-P2.54-FD-1
  round 1.6 hole 1: 1(-1.27,0) 2(1.27,0)
R0603
  rect 0.806x0.864 smd: 1(-0.753,0) 2(0.753,0)
RD901F
  round 1.524 hole 0.914: 1(-2.54,0) 2(0,0) 3(2.54,0)
  oval 1.524x2.6 hole 0.914x2: 4(4.8,7.5) 5(-4.8,7.5)
SOD-123F_L2.7-W1.6-LS3.8-RD
  rect 1.1x1 smd: 1(-1.735,0) 2(1.735,0)
SOIC-8_L4.9-W3.9-P1.27-LS6.0-BL
  oval 0.588x2.045 smd: 1(-1.905,-2.772) 2(-0.635,-2.772) 3(0.635,-2.772) 4(1.905,-2.772) 5(1.905,2.772) 6(0.635,2.772) 7(-0.635,2.772) 8(-1.905,2.772)
SOP-16_L9.9-W3.9-P1.27-LS6.0-BL
  oval 0.574x2.038 smd: 1(-4.445,-2.769) 2(-3.175,-2.769) 3(-1.905,-2.769) 4(-0.635,-2.769) 5(0.635,-2.769) 6(1.905,-2.769) 7(3.175,-2.769) 8(4.445,-2.769) 9(4.445,2.769) 10(3.175,2.769) 11(1.905,2.769) 12(0.635,2.769) 13(-0.635,2.769) 14(-1.905,2.769) 15(-3.175,2.769) 16(-4.445,2.769)
SOT-23-3_L2.9-W1.3-P1.90-LS2.4-BR
  rect 1.25x0.7 smd: 1(1,-0.95) 2(1,0.95) 3(-1,0)
SOT-89-3_L4.5-W2.5-P1.50-LS4.2-BR
  rect 1.575x0.672 smd: 1(1.356,-1.5) 3(1.356,1.5)
  custom 5.377x1.9 smd: 2(-1.356,0)

## Nets
As in the schematic.

Pads without a net: DC1 3; U14 2 15; VR1 4 5; VR2 4 5; VR3 4 5; VR5 4 5; VR6 4 5

## Via types
v1: diameter 0.61, hole 0.305, Top Layer to Bottom Layer, 21 vias

## Routing (per net, layer and track width the routed paths; a pad name or vN(x,y) marks a point on that pad's centre or on a via; arc(x,y) is an arc through that point)
+5V: length 28.2
  Top Layer w0.254: C50.1 37.26,57.06 U19.1 40.41,50.82 39.37,49.78 VR5.3 VR5.2 ; Q1.3 v1(44.72,40.13)
  Bottom Layer w0.254: VR5.2 41.91,42.94 v1(44.72,40.13)
GND:
  vias: v1(28.25,18.72) v1(46.89,28.93) v1(63.81,27.97) v1(63.78,19.76)
VCC: length 131.4
  Top Layer w0.254: U27.8 v1(34.93,11.43) ; v1(43.41,57.06) 43.41,62.21 44.7,63.5 44.7,71.5 44.02,72.19 DC1.2 41.85,72.26 C47.1 ; v1(33.61,32.11) 35.03,32.11 35.74,32.82 52.32,32.82 53.01,33.51 U21.8 58.04,36.31 R99.2
  Bottom Layer w0.254: v1(71.65,31.7) 72.44,32.5 v1(72.44,40.18) 72.44,40.18 61.86,40.18 v1(58.51,36.83) 43.41,51.93 v1(43.41,57.06) ; v1(34.93,11.43) 33.61,12.76 v1(33.61,32.11)
ENV: length 20.3
  Top Layer w0.254: VR3.2 VR3.3 51.94,45.85 48.94,42.84 D16.1 48.94,39.64 C46.2 49.97,37.07 48.15,35.25 Q1.1
FX: length 12.8
  Top Layer w0.254: 32.38,27.31 33.61,28.54 U14.9 35.2,29.57 35.56,29.21 36.54,29.21 R88.2 ; 32.38,27.31 31.55,27.31 ; 32.38,27.31 33.02,26.67 33.02,23.11 32.51,22.61 31.56,22.61
IN: length 56.3
  Top Layer w0.254: C38.1 41.16,15.24 v1(26.1,15.24) 26.1,11.47 U27.1 U27.2
  Bottom Layer w0.254: v1(26.1,15.24) 12.7,28.64 VR1.1
JACK_IN: length 7.3
  Top Layer w0.254: C28.1 32,2.79 R4.2 32.01,2.79 U26.1
JACK_OUT: length 6.1
  Top Layer w0.254: U26.5 51.17,2.79 R14.2 R13.2
VREF: length 121.9
  Top Layer w0.254: U21.5 61.85,30.73 60.58,29.46 v1(60.58,27.96) ; v1(68.82,34.72) 72.36,34.72 U20.1 U20.2 73.71,36.12 76.25,38.66 v1(76.25,40.18) ; C51.1 22.32,3.56 25.03,3.56 v1(25.78,4.31) ; v1(23.48,34.27) 23.48,36.3 ; v1(38.07,34.27) R86.2
  Bottom Layer w0.254: v1(23.48,34.27) 23.48,32.71 27.51,28.68 28.52,28.68 34.11,34.27 v1(38.07,34.27) ; v1(68.82,34.72) 62.06,27.96 v1(60.58,27.96) 54.28,34.27 v1(38.07,34.27) ; v1(38.07,34.27) 38.07,9.52 32.84,4.29 25.8,4.29 v1(25.78,4.31)
$1N6634: length 6
  Top Layer w0.254: U11.1 40.64,11.43 R103.1
$1N12632: length 8.1
  Top Layer w0.254: 73.23,28.4 73.23,31.67 73.19,31.71 74.99,31.71 74.99,34.63 U20.3
$1N13415: length 4.4
  Top Layer w0.254: C28.2 28.12,2.8 R1.2 R3.1
$1N13416: length 8.5
  Top Layer w0.254: U27.3 24.64,8.89 23.75,8 R3.2 23.7,4.26 C51.2
$1N13421: length 4.6
  Top Layer w0.254: R14.1 51.18,8.83 C27.2
$1N13425: length 39
  Bottom Layer w0.254: VR1.3 9.27,47.37 14.73,47.37 16.84,45.26 16.84,35.93 v1(30.16,22.61)
$1N13428: length 19.4
  Top Layer w0.254: U27.7 U27.6 C27.1
$1N13429: length 47
  Bottom Layer w0.254: VR1.2 10.16,29.06 v1(31.6,7.62)
$1N13550: length 4.8
  Top Layer w0.254: U11.2 U26.3
$4N2873: length 24.4
  Top Layer w0.254: VR6.3 VR6.2 73.66,40.23 U20.7 73.71,38.28 71.88,36.45 68.07,36.45 67.18,35.56 67.18,32.39 68.01,31.56 C44.1
$4N3799: length 4.7
  Top Layer w0.254: R96.1 69.46,27.02 R101.1 69.47,29.27 C44.2
$4N3804: length 16.1
  Top Layer w0.254: R97.1 57.82,22.1 60.36,24.64 59.31,25.69 U21.2 ; R96.2 60.48,24.71 D14.1
$4N3875: length 5.9
  Top Layer w0.254: U21.1 58.04,25.69 56.99,24.64 D14.2 D15.1
$4N4025: length 11.9
  Top Layer w0.254: 51.4,24.64 D15.2 ; 51.4,24.64 53.94,22.1 R97.2 ; 51.4,24.64 52.16,25.39 52.16,25.48 55.5,28.83 R98.1
$4N4078: length 10.3
  Top Layer w0.254: R100.2 R95.2 58.61,40.97 C45.2 58.61,38.94 59.31,38.24 U21.7
$4N4084: length 28.4
  Top Layer w0.254: 60.58,34.96 60.93,35.31 63.25,35.31 65.53,33.02 65.53,28.19 66.69,27.04 R101.2 ; 60.58,34.96 U21.6 60.58,31.88 60.19,31.49 R98.2 ; 60.58,34.96 60.58,36.31 R99.1 60.06,38.94 C45.1 60.01,40.97 R95.1
$4N4197: length 13.6
  Top Layer w0.254: 74.98,41.56 74.98,44.63 VR6.1 ; 74.98,41.56 75.59,42.16 77.65,42.16 78.61,41.2 R94.2 ; 74.98,41.56 U20.6
$4N4200: length 50.5
  Top Layer w0.254: C38.2 67,15.29 78.61,26.9 R94.1
$4N4289: length 2.2
  Top Layer w0.254: D16.2 R100.1
$4N4526: length 4.7
  Top Layer w0.254: VR3.1 R102.2
$5N1600: length 9.1
  Top Layer w0.254: C30.1 24.96,31.24 26.03,31.24 26.44,30.84 U14.7 29.57,30.84 29.82,31.09 29.82,33.12 29.57,33.38 U14.5
$5N2883: length 25.1
  Top Layer w0.254: R83.2 26.01,29.19 26.39,29.57 v1(28.07,29.57) 28.07,27.09 30.11,25.05 R84.1
  Bottom Layer w0.254: VR2.1 28.57,42.67 28.07,42.16 v1(28.07,29.57)
$5N3271: length 8.9
  Top Layer w0.254: U14.12 32.11,33.38 31.85,33.12 31.85,31.09 32.11,30.84 U14.10 35.15,30.84 35.54,31.22 C31.1
$5N4878: length 5.5
  Top Layer w0.254: R104.1 25,36.31 ; 25,36.31 25.01,36.32 26.03,36.32 26.44,35.92 U14.3 ; 25,36.31 R82.1
$5N4886: length 20
  Top Layer w0.254: R85.2 24.23,39.86 24.23,35.02 R81.1 26.01,34.27 26.39,34.65 U14.4 30,34.65 30.61,34.04 30.61,30.23 30.04,29.66 R89.1
$5N5245: length 7.8
  Top Layer w0.254: VR2.2 VR2.3 23.5,45.84 R85.1
$5N5371: length 3.1
  Top Layer w0.254: U14.13 35.08,34.65 35.43,34.29 36.54,34.29 R87.1
$5N5377: length 16.4
  Top Layer w0.254: R84.2 30.81,25.82 30.81,29.03 31.24,29.46 31.24,35.05 32.11,35.92 U14.14 35.03,35.92 35.41,36.3 R86.1
$5N5607: length 25.6
  Top Layer w0.254: R104.2 22.51,38.51 22.02,38.02 22.02,25.43 24.7,22.75 C32.2
$5N5701: length 10.4
  Top Layer w0.254: R91.1 R90.1 36.56,38.46 U14.16 U14.1
$5N5821: length 2
  Top Layer w0.254: Q1.2 Q2.1
$5N6853: length 9.7
  Top Layer w0.254: Q2.2 41.72,41.08 39.12,38.48 R90.2
$5N6944: length 8.6
  Top Layer w0.254: R91.2 38.99,40.39 VR5.1

## Copper pours and planes (outline as drawn; the poured copper is in the pictures)
GND on Top Layer: 0,73.66 5.08,73.66 5.08,78.74 78.74,78.74 78.74,73.66 83.82,73.66 83.82,0 0,0
GND on Bottom Layer: 0,73.66 5.08,73.66 5.08,78.74 78.74,78.74 78.74,73.66 83.82,73.66 83.82,0 0,0

## Text on the board
Bottom Silkscreen Layer: MIX | RES | BIAS | DEC | SENS
